# Altium schematic sheet mcu.SchDoc: Science Board MCU
size A4; DrawnBy: Adrianna Ascalon
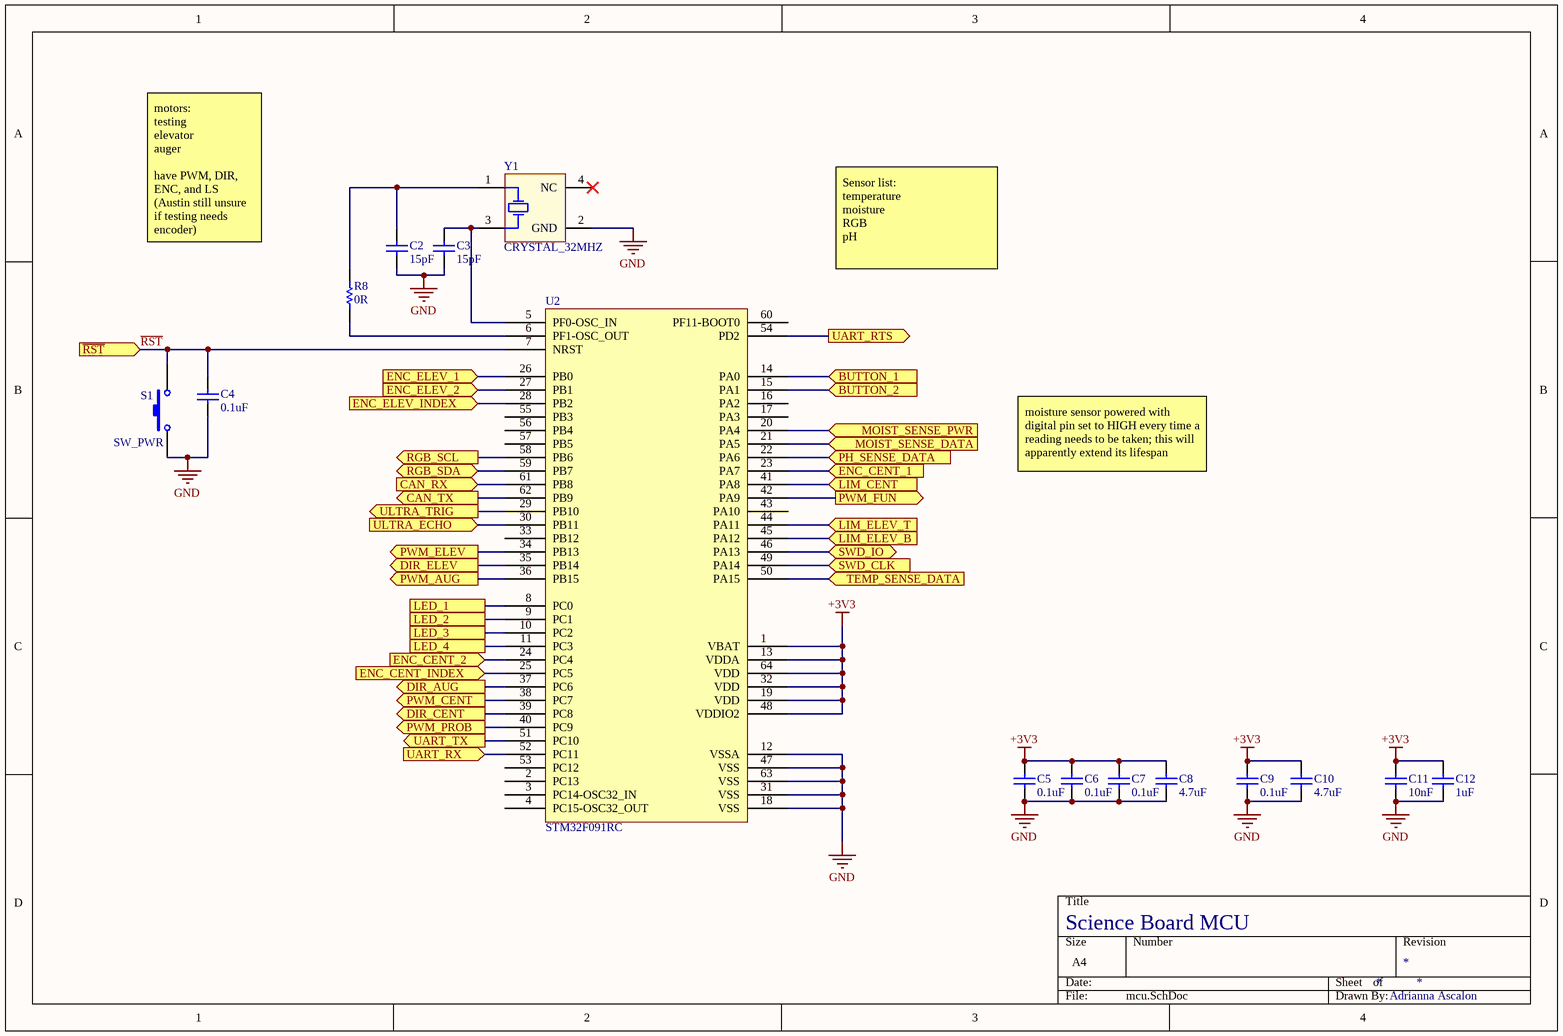
[diagram p0: mcu.SchDoc]

## Parts
C2  value 15pF  [CAPC0603(1608)55_N]  (hidden comment: CAP_15pF_0603)
C3  value 15pF  [CAPC0603(1608)55_N]  (hidden comment: CAP_15pF_0603)
C4  value 0.1uF  [CAPC0603(1608)55_N]  (hidden comment: CAP_0.1uF_16V_0603)
C5  value 0.1uF  [CAPC0603(1608)55_N]  (hidden comment: CAP_0.1uF_16V_0603)
C6  value 0.1uF  [CAPC0603(1608)55_N]  (hidden comment: CAP_0.1uF_16V_0603)
C7  value 0.1uF  [CAPC0603(1608)55_N]  (hidden comment: CAP_0.1uF_16V_0603)
C8  value 4.7uF  [CAPC0603(1608)55_N]  (hidden comment: CAP_4.7uF_0603)
C9  value 0.1uF  [CAPC0603(1608)55_N]  (hidden comment: CAP_0.1uF_16V_0603)
C10  value 4.7uF  [CAPC0603(1608)55_N]  (hidden comment: CAP_4.7uF_0603)
C11  value 10nF  [CAPC0603(1608)55_N]  (hidden comment: CAP_10nF_0603)
C12  value 1uF  [CAPC0603(1608)55_N]  (hidden comment: CAP_1uF_16V_0603)
R8  value 0R  [RESC0603(1608)_N]  (hidden comment: RES_0R_0603)
S1  SW_PWR  [PTS830GM140]
U2  STM32F091RC  [STM_LQFP64_N]
Y1  CRYSTAL_32MHZ  [AVX-CX2520DB32000D0GEJZ1-4_V]

## Ports
BUTTON_1 (in), BUTTON_2 (in), CAN_RX (in), CAN_TX (out), DIR_AUG (out), DIR_CENT (out), DIR_ELEV (out), ENC_CENT_1 (in), ENC_CENT_2 (in), ENC_CENT_INDEX (in), ENC_ELEV_1 (in), ENC_ELEV_2 (in), ENC_ELEV_INDEX (in), LED_1, LED_2, LED_3, LED_4, LIM_CENT (in), LIM_ELEV_B (in), LIM_ELEV_T (in), MOIST_SENSE_DATA (in), MOIST_SENSE_PWR (in), PH_SENSE_DATA (in), PWM_AUG (out), PWM_CENT (out), PWM_ELEV (out), PWM_FUN (out), PWM_PROB (out), RGB_SCL (out), RGB_SDA (bidir), SWD_CLK (in), SWD_IO (bidir), TEMP_SENSE_DATA (in), UART_RTS (out), UART_RX (in), UART_TX (out), ULTRA_ECHO (in), ULTRA_TRIG (out), ~{RST} (in)

## Nets
+3V3: C5.1 C6.1 C7.1 C8.2 C9.1 C10.2 C11.2 C12.2 U2.1(VBAT) U2.13(VDDA) U2.19(VDD) U2.32(VDD) U2.48(VDDIO2) U2.64(VDD)
GND: C2.1 C3.1 C4.1 C5.2 C6.2 C7.2 C8.1 C9.2 C10.1 C11.1 C12.1 S1.1 U2.12(VSSA) U2.18(VSS) U2.31(VSS) U2.47(VSS) U2.63(VSS) Y1.2(GND)
BUTTON_1: U2.14(PA0) ; port BUTTON_1
BUTTON_2: U2.15(PA1) ; port BUTTON_2
CAN_RX: U2.61(PB8) ; port CAN_RX
CAN_TX: U2.62(PB9) ; port CAN_TX
DIR_AUG: U2.37(PC6) ; port DIR_AUG
DIR_CENT: U2.39(PC8) ; port DIR_CENT
DIR_ELEV: U2.35(PB14) ; port DIR_ELEV
ENC_CENT_1: U2.23(PA7) ; port ENC_CENT_1
ENC_CENT_2: U2.24(PC4) ; port ENC_CENT_2
ENC_CENT_INDEX: U2.25(PC5) ; port ENC_CENT_INDEX
ENC_ELEV_1: U2.26(PB0) ; port ENC_ELEV_1
ENC_ELEV_2: U2.27(PB1) ; port ENC_ELEV_2
ENC_ELEV_INDEX: U2.28(PB2) ; port ENC_ELEV_INDEX
LED_1: U2.8(PC0) ; port LED_1
LED_2: U2.9(PC1) ; port LED_2
LED_3: U2.10(PC2) ; port LED_3
LED_4: U2.11(PC3) ; port LED_4
LIM_CENT: U2.41(PA8) ; port LIM_CENT
LIM_ELEV_B: U2.45(PA12) ; port LIM_ELEV_B
LIM_ELEV_T: U2.44(PA11) ; port LIM_ELEV_T
MOIST_SENSE_DATA: U2.21(PA5) ; port MOIST_SENSE_DATA
MOIST_SENSE_PWR: U2.20(PA4) ; port MOIST_SENSE_PWR
PH_SENSE_DATA: U2.22(PA6) ; port PH_SENSE_DATA
PWM_AUG: U2.36(PB15) ; port PWM_AUG
PWM_CENT: U2.38(PC7) ; port PWM_CENT
PWM_ELEV: U2.34(PB13) ; port PWM_ELEV
PWM_FUN: U2.42(PA9) ; port PWM_FUN
PWM_PROB: U2.40(PC9) ; port PWM_PROB
~{RST}: C4.2 S1.2 U2.7(NRST) ; port ~{RST}
RGB_SCL: U2.58(PB6) ; port RGB_SCL
RGB_SDA: U2.59(PB7) ; port RGB_SDA
SWD_CLK: U2.49(PA14) ; port SWD_CLK
SWD_IO: U2.46(PA13) ; port SWD_IO
TEMP_SENSE_DATA: U2.50(PA15) ; port TEMP_SENSE_DATA
UART_RTS: U2.54(PD2) ; port UART_RTS
UART_RX: U2.52(PC11) ; port UART_RX
UART_TX: U2.51(PC10) ; port UART_TX
ULTRA_ECHO: U2.30(PB11) ; port ULTRA_ECHO
ULTRA_TRIG: U2.29(PB10) ; port ULTRA_TRIG
NetC2_2: C2.2 R8.2 Y1.1(HOT)
NetC3_2: C3.2 U2.5(PF0-OSC_IN) Y1.3(HOT)
NetR8_1: R8.1 U2.6(PF1-OSC_OUT)

Not connected (* = marked no-connect by the designer): U2 2(PC13) 3(PC14-OSC32_IN) 4(PC15-OSC32_OUT) 16(PA2) 17(PA3) 33(PB12) 43(PA10) 53(PC12) 55(PB3) 56(PB4) 57(PB5) 60(PF11-BOOT0); Y1 4(NC)*

## Notes on the sheet
- motors:
  testing
  elevator
  auger
  have PWM, DIR, ENC, and LS
  (Austin still unsure if testing needs encoder)
  Auger doesn't need ENC or LS
- Sensor list:
  temperature
  moisture
  RGB
  pH
- moisture sensor powered with digital pin set to HIGH every time a reading needs to be taken; this will apparently extend its lifespan

## Library data of the parts
C2 C3 = CAP_15pF_0603: CAP CER 15PF 250V NPO 0603; Manufacturer: Yageo; MPN: AC0603JRNPOYBN150; Temperature Coefficient: NP0; Dimensions: 0.063" L x 0.031" W (1.60mm x 0.80mm); Package: 0603 (1608 Metric); Voltage Rating: 250v; Digikey Part Number: 311-3282-1-ND
C4-C7 C9 = CAP_0.1uF_16V_0603: CAP CER 0.1UF 16V X7R 0603; Manufacturer: Yageo; MPN: CC0603KRX7R7BB104; Dimensions: 0.063" L x 0.031" W (1.60mm x 0.80mm); Package: 0603 (1608 Metric); Temperature Coefficient: X7R; Voltage Rating: 16V; Digikey Part Number: 311-1088-1-ND
C8 C10 = CAP_4.7uF_0603: CAP CER 4.7UF 6.3V X5R 0603; Manufacturer: Yageo; MPN: CC0603KRX5R5BB475; Dimensions: 0.063" L x 0.031" W (1.60mm x 0.80mm); Package: 0603 (1608 Metric); Temperature Coefficient: X5R; Voltage Rating: 6.3V; Digikey Part Number: 311-1521-1-ND
C11 = CAP_10nF_0603: CAP CER 10000PF 16V X7R 0603; Manufacturer: Yageo; MPN: CC0603KRX7R7BB103; Dimensions: 0.063" L x 0.031" W (1.60mm x 0.80mm); Package: 0603 (1608 Metric); Temperature Coefficient: X7R; Voltage Rating: 16V; Digikey Part Number: 311-3369-1-ND
C12 = CAP_1uF_16V_0603: CAP CER 1UF 16V Y5V 0603; Manufacturer: Yageo; MPN: CC0603ZRY5V7BB105; Dimensions: 0.063" L x 0.031" W (1.60mm x 0.80mm); Package: 0603 (1608 Metric); Temperature Coefficient: Y5V; Voltage Rating: 16V; Digikey Part Number: 311-1372-1-ND
R8 = RES_0R_0603: RES SMD 0 OHM JUMPER 1/10W 0603; Manufacturer: Yageo; MPN: RC0603JR-070RL; Package: 0603 (1608 Metric); Dimensions: 0.063" L x 0.031" W (1.60mm x 0.80mm); Digikey Part Number: 311-0.0GRCT-ND
S1 = SW_PWR: Power Switch (Red); pin to pad: 2>4; MPN: PTS830GM140 SMTR LFS; Manufacturer: C&K; ComponentLink1Description: Datasheet; ComponentLink1URL: https://www.ckswitches.com/media/1478/pts830.pdf; Digikey Part Number: CKN10587CT-ND
U2 = STM32F091RC: Manufacturer: STMicroelectronics; Package: 64-LQFP; ComponentLink1Description: Datasheet; ComponentLink1URL: https://www.st.com/content/ccc/resource/technical/document/datasheet/95/3c/2e/5b/21/09/45/a6/DM00115237.pdf/files/DM00115237.pdf/jcr:content/translations/en.DM00115237.pdf#%5B%7B%22num%22%3A96%2C%22gen%22%3A0%7D%2C%7B%22name%22%3A%22XYZ%22%7D%2C67%2C755%2Cnull%5D; MPN: STM32F091RC; Digikey Part Number: 497-15167-ND
Y1 = CRYSTAL_32MHZ: CRYSTAL 32MHZ 8PF SMD; Manufacturer: Kyocera International Inc. Electronic Components; MPN: CX2520DB32000D0GPSC1; Package: 4-SMD, No Lead; Dimensions: 0.098" L x 0.079" W (2.50mm x 2.00mm); Digikey Part Number: 1253-1730-1-ND